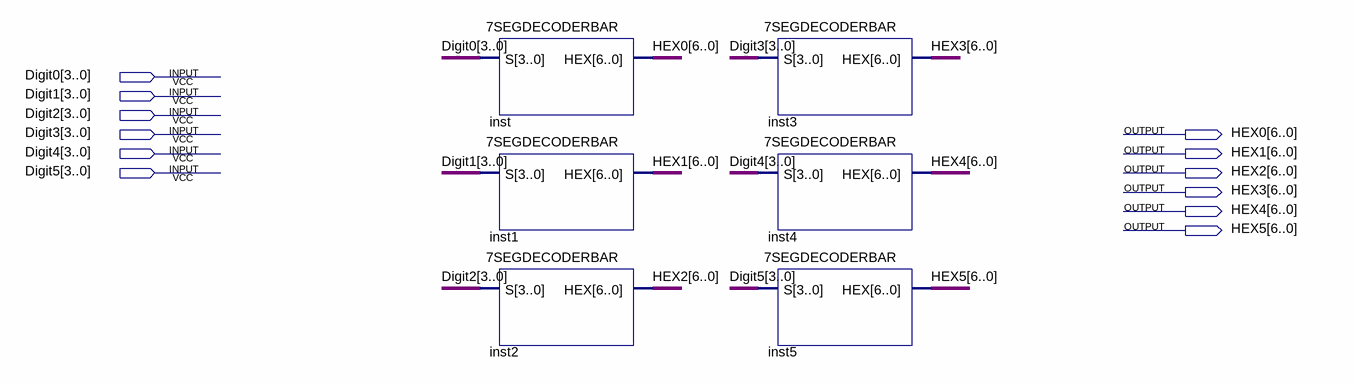
[diagram p0: schematic sheet]
// Quartus schematic 7-Segment-Display-Controller.bdf as structural Verilog: 6 symbols, 12 pins
module \7-Segment-Display-Controller  (
  input  [3:0] Digit0,
  input  [3:0] Digit1,
  input  [3:0] Digit2,
  input  [3:0] Digit3,
  input  [3:0] Digit4,
  input  [3:0] Digit5,
  output [6:0] HEX0,
  output [6:0] HEX1,
  output [6:0] HEX2,
  output [6:0] HEX3,
  output [6:0] HEX4,
  output [6:0] HEX5
);

  \7SEGDECODERBAR  inst (.S(Digit0), .HEX(HEX0));
  \7SEGDECODERBAR  inst1 (.S(Digit1), .HEX(HEX1));
  \7SEGDECODERBAR  inst2 (.S(Digit2), .HEX(HEX2));
  \7SEGDECODERBAR  inst3 (.S(Digit3), .HEX(HEX3));
  \7SEGDECODERBAR  inst4 (.S(Digit4), .HEX(HEX4));
  \7SEGDECODERBAR  inst5 (.S(Digit5), .HEX(HEX5));
endmodule
